# Altium project Pulsoksymetr.PrjPcb
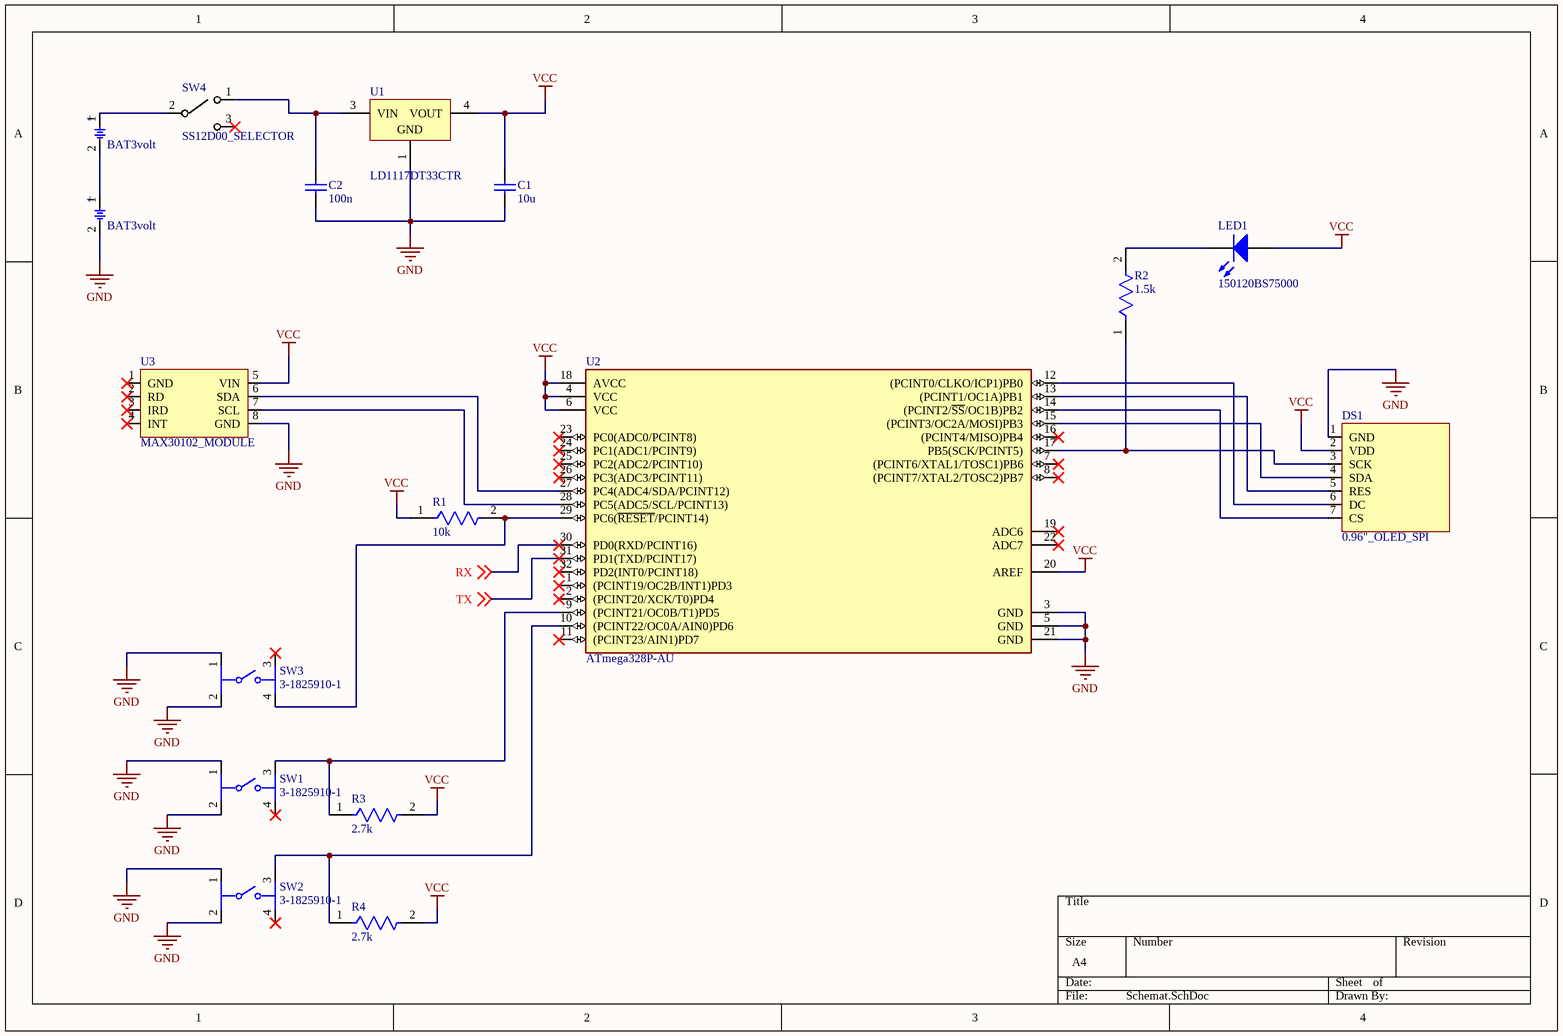
[diagram p0: Schemat.SchDoc]
1 sheet, 17 parts. Net scope: global (net labels, ports and power ports of the same name join across sheets).
Board file: PCB.PcbDoc

## Sheet Schemat.SchDoc
size A4; SheetNumber: 1; SheetTotal: 1

### Parts
BT1  BAT3volt  [BTH2032]
BT2  BAT3volt  [BTH2032]
C1  10u  [CAPC3216X180X50LL20T25]
C2  100n  [CAPC3216X94X50ML20T25]
DS1  0.96"_OLED_SPI  [0.96"_OLED_SPI]
LED1  150120BS75000  [1206_A]
R1  10k  [FP-CRCW1206-e3-IPC_C]
R2  1.5k  [FP-CRCW1206-e3-IPC_C]
R3  2.7k  [FP-CRCW1206-e3-IPC_C]
R4  2.7k  [FP-CRCW1206-e3-IPC_C]
SW1  3-1825910-1  [FP-3-1825910-1-MFG]
SW2  3-1825910-1  [FP-3-1825910-1-MFG]
SW3  3-1825910-1  [FP-3-1825910-1-MFG]
SW4  SS12D00_SELECTOR  [SS12D00_SELECTOR]
U1  LD1117DT33CTR  [TO-252_N]
U2  ATmega328P-AU  [FP-32A-MFG]
U3  MAX30102_MODULE  [MAX30102_MODULE]

### Nets
GND: BT1.2 C1.1 C2.1 DS1.1(GND) SW1.1 SW1.2 SW2.1 SW2.2 SW3.1 SW3.2 U1.1(GND) U2.3(GND) U2.5(GND) U2.21(GND) U3.8(GND)
VCC: C1.2 DS1.2(VDD) LED1.2(A) R1.1 R3.2 R4.2 U1.4(VOUT) U2.4(VCC) U2.6(VCC) U2.18(AVCC) U2.20(AREF) U3.5(VIN)
RX: U2.30(PD0(RXD/PCINT16)) ; off-sheet RX
TX: U2.31(PD1(TXD/PCINT17)) ; off-sheet TX
NetBT1_1: BT1.1 BT2.2
NetBT2_1: BT2.1 SW4.2
NetC2_2: C2.2 SW4.1 U1.3(VIN)
NetDS1_3: DS1.3(SCK) R2.1 U2.17(PB5(SCK/PCINT5))
NetDS1_4: DS1.4(SDA) U2.15((PCINT3/OC2A/MOSI)PB3)
NetDS1_5: DS1.5(RES) U2.13((PCINT1/OC1A)PB1)
NetDS1_6: DS1.6(DC) U2.12((PCINT0/CLKO/ICP1)PB0)
NetDS1_7: DS1.7(CS) U2.14((PCINT2/~{SS}/OC1B)PB2)
NetLED1_1: LED1.1(K) R2.2
NetR1_2: R1.2 SW3.4 U2.29(PC6(~{RESET}/PCINT14))
NetR3_1: R3.1 SW1.3 U2.9((PCINT21/OC0B/T1)PD5)
NetR4_1: R4.1 SW2.3 U2.10((PCINT22/OC0A/AIN0)PD6)
NetU2_27: U2.27(PC4(ADC4/SDA/PCINT12)) U3.6(SDA)
NetU2_28: U2.28(PC5(ADC5/SCL/PCINT13)) U3.7(SCL)

Not connected (* = marked no-connect by the designer): SW1 4*; SW2 4*; SW3 3*; SW4 3*; U2 1((PCINT19/OC2B/INT1)PD3)* 2((PCINT20/XCK/T0)PD4)* 7((PCINT6/XTAL1/TOSC1)PB6)* 8((PCINT7/XTAL2/TOSC2)PB7)* 11((PCINT23/AIN1)PD7)* 16((PCINT4/MISO)PB4)* 19(ADC6)* 22(ADC7)* 23(PC0(ADC0/PCINT8))* 24(PC1(ADC1/PCINT9))* 25(PC2(ADC2/PCINT10))* 26(PC3(ADC3/PCINT11))* 32(PD2(INT0/PCINT18))*; U3 1(GND)* 2(RD)* 3(IRD)* 4(INT)*

### Notes on the sheet
- (near BT2) +
- (near BT1) +

### Library data of the parts
BT1 BT2 = BATH_CR2032: BATTERY HOLDER, CR2032; VALUE: BAT3volt; MANF_P#: -; .: http://www.chila.ir
C1 = CMP-2000-06013-1: Chip Capacitor, 10 uF, +/- 10%, 10 V, -55 to 125 degC, 1206 (3216 Metric), RoHS, Tape and Reel; Type: SMDMLCCX7R6.3-250VDCCommericalGrade; Class: Class1; Case Height: 1.6mm; Temperature Coefficient / Code: +/-15%; Capacitance: 10uF; Brand: Kemet; Case Length: 3.2mm; Dissipation Factor DF: 5; Voltage Rating: 10V; Dielectric: X7R; Tolerance: 10%; Package Reference: 1206; Dimensions: 1.6mmWx3.2mmLx1.6mmH; Series: C1206C; Minimum Operating Temperature: -55C; RoHS: Details; Termination Style: SMD/SMT; Mounting Technology: SurfaceMount; Manufacturer: Kemet; Product Category: MultilayerCeramicCapacitorsMLCC-SMD/SMT; Case Code - mm: 3216; Manufacturer URL: http://www.kemet.com/; Product: GeneralTypeMLCCs; Package Description: 2-Pin Surface Mount Device, Body 3.2 x 1.6 mm; Case Width: 1.6mm; Factory Pack Quantity: 2000; Package / Case: 1206(3216metric); Datasheet URL: http://www.kemet.com/docfinder?Partnumber=C1206C106K8RACTU; Datasheet Version: 02/2016; Operating Temperature Range: -55Cto+125C; Voltage Rating DC: 10V; Case Code - in: 1206; Maximum Operating Temperature: +125C; Packaging: Reel
C2 = CMP-2000-05018-1: Chip Capacitor, Ceramic, 100 nF, 10%, 50 V, 1206, RoHS, Tape and Reel; Manufacturer: AVX; Rated Voltage: 50V; Dielectric: X7R; Capacitance: 100nF; Datasheet URL: http://www.mouser.com/ds/2/40/cauto-360.pdf; Manufacturer URL: http://www.avx.com/; Datasheet Version: Sep-14; Tolerance (%): ±10%; Case Size/Dimension: 1206
DS1 = 0.96"_OLED_SPI: 0.96 inch oled display with SPI interface
LED1 = CMP-1426-00015-1: SMD mono-color Chip LED, WL-SMCW, Blue; Manufacturer: Wuerth Elektronik; ComponentLink2Description: Datasheet; ComponentLink1URL: http://www.we-online.com; PartNumber: 150120BS75000; ComponentLink1Description: Manufacturer URL; ComponentLink2URL: http://katalog.we-online.com/led/datasheet/150120BS75000.pdf; PackageReference: 1206_A; Color: Blue
R1-R4 = CMP-2003-04807-2: RES Thick Film, 10kΩ, 1%, 0.25W, 100ppm/°C, 1206; Working Voltage: 200V; Max Power Dissipation: 250mW; Resistance: 10kR; Tolerance: 1%; Width: 0.063inch; Height: 0.55mm; Number of Pins: 2; Voltage Rating: 200V; Temperature Coefficient: 100ppm/°C; Military Standard: Not; Features: Automotive AEC-Q200; Depth: 1.6mm; Radiation Hardening: No; Termination: SMD/SMT; Case Code (Imperial): 1206; Weight: 0.000353oz; Length: 3.2mm; Package Quantity: 10; Voltage Rating (DC): 200V; Case/Package: 1206; Min Operating Temperature: -55°C; Number of Terminations: 2; Composition: Thick Film; Contact Plating: Tin; Power Rating: 250mW; Packaging: Tape and Reel; Max Operating Temperature: 155°C; Lead Free: Lead Free; Case Code (Metric): 3216
SW1-SW3 = CMP-03407-000001-1: SWITCH TACTILE SPST-NO 0.05A 24V; Manufacturer: TE Connectivity; Operating Force: 160gf; Contact Current Rating: 50mA; Contact Resistance: 100mΩ; Electromechanical Life: 100000Cycles; Device Class L1: Electromechanical; ComponentLink2URL: https://www.te.com/commerce/DocumentDelivery/DDEController?Action=srchrtrv&DocNm=1825910&DocType=Customer+Drawing&DocLang=English; Category: Switch; Device Class L2: Switches; Temperature: -35°C to +85°C; RoHS: TRUE; Mount: Through Hole; Manufacturer Part Number: 3-1825910-1; Automotive: No; Lead Free: Yes; Device Class L3: Tactile Switches; ComponentLink2Description: Datasheet; Temperature Range High: +85°C; Height: 17.3mm; Package: 0; Temperature Range Low: -35°C; Throw Configuration: SPST-NO; Digikey Description: SWITCH TACTILE SPST-NO 0.05A 24V; Octopart: https://octopart.com/3-1825910-1-te+connectivity-46506874
SW4 = SS12D00_SELECTOR: 3.5 x 8.6 mm selector switch
U1 = CMP-0244-00089-1: Fixed Low Drop Positive Voltage Regulator, 3.3V, 3-Pin DPAK, Tape and Reel; PackageVersion: 2011; ComponentLink1URL: http://www.st.com; DatasheetVersion: 1/11/2011; PackageReference: TO-252; ComponentLink1Description: Manufacturer URL; ComponentLink2URL: http://www.st.com/internet/com/TECHNICAL_RESOURCES/TECHNICAL_LITERATURE/DATASHEET/CD00000544.pdf; ComponentLink2Description: Datasheet; PackageDescription: 3-Pin Transistor Outline Package 2.28 mm Pitch, 9.7 mm Lead Span (DPAK)
U2 = CMP-06276-000013-1: IC MCU 8BIT 32KB FLASH 32TQFP; Manufacturer: Microchip; Nominal Supply Current: 0.04-5.2mA; Number Of Timers/Counters: 3; Number Of Adc Channels: 8; Number Of I2C Channels: 1; Min Supply Voltage: 1.8V; Standoff Height: 0.05mm; Data Bus Width: 8bits; Ram Size: 2KBytes; Max Supply Voltage: 5.5V; Interface: I2C,SPI,UART,USART,2-Wire; Frequency: 20MHz; Number Of Pwm Channels: 6; Memory Size: 32KBytes; Number Of I/Os: 23; Core Architecture: AVR; Temperature: -40°C to +85°C; Number Of Spi Channels: 1; Digikey Description: IC MCU 8BIT 32KB FLASH 32TQFP; Category: IC; RoHS: TRUE; Memory Type: FLASH; Package: 32A; ComponentLink2Description: Datasheet; Number Of Uart Channels: 1; Temperature Range High: +85°C; Octopart: https://octopart.com/atmega328p-au-microchip-77760215; Footprint Url: http://ww1.microchip.com/downloads/en/appnotes/atmel-8826-seeprom-pcb-mounting-guidelines-surface-mount-packages-applicationnote.pdf; Lead Free: Yes; Device Class L1: Integrated Circuits (ICs); Device Class L2: Embedded Processors and Controllers; Ipc Land Pattern Name: QFP80P900X900X120-32; Number Of A/D Converters: 1; Number Of Cores: 1; Automotive: No; Temperature Range Low: -40°C; Mouser Description: ATmega Series 32 KB Flash 2 KB SRAM 20 MHz 8-Bit Microcontroller - TQFP-32; ComponentLink2URL: http://ww1.microchip.com/downloads/en/DeviceDoc/ATmega48A-PA-88A-PA-168A-PA-328-P-DS-DS40002061A.pdf; Height: 1.2mm; Manufacturer Part Number: ATmega328P-AU; Device Class L3: Microcontrollers
U3 = MAX30102_MODULE: Arduino module for MAX30102 pulseoxymeter sensor